# EAGLE design propulsion_shield (EAGLE 6.5.0)
CNAME: Kbots - Propulsion Shield; CREVISION: 1.0; DESIGNER: LAGORCE X., HAESSIG G.
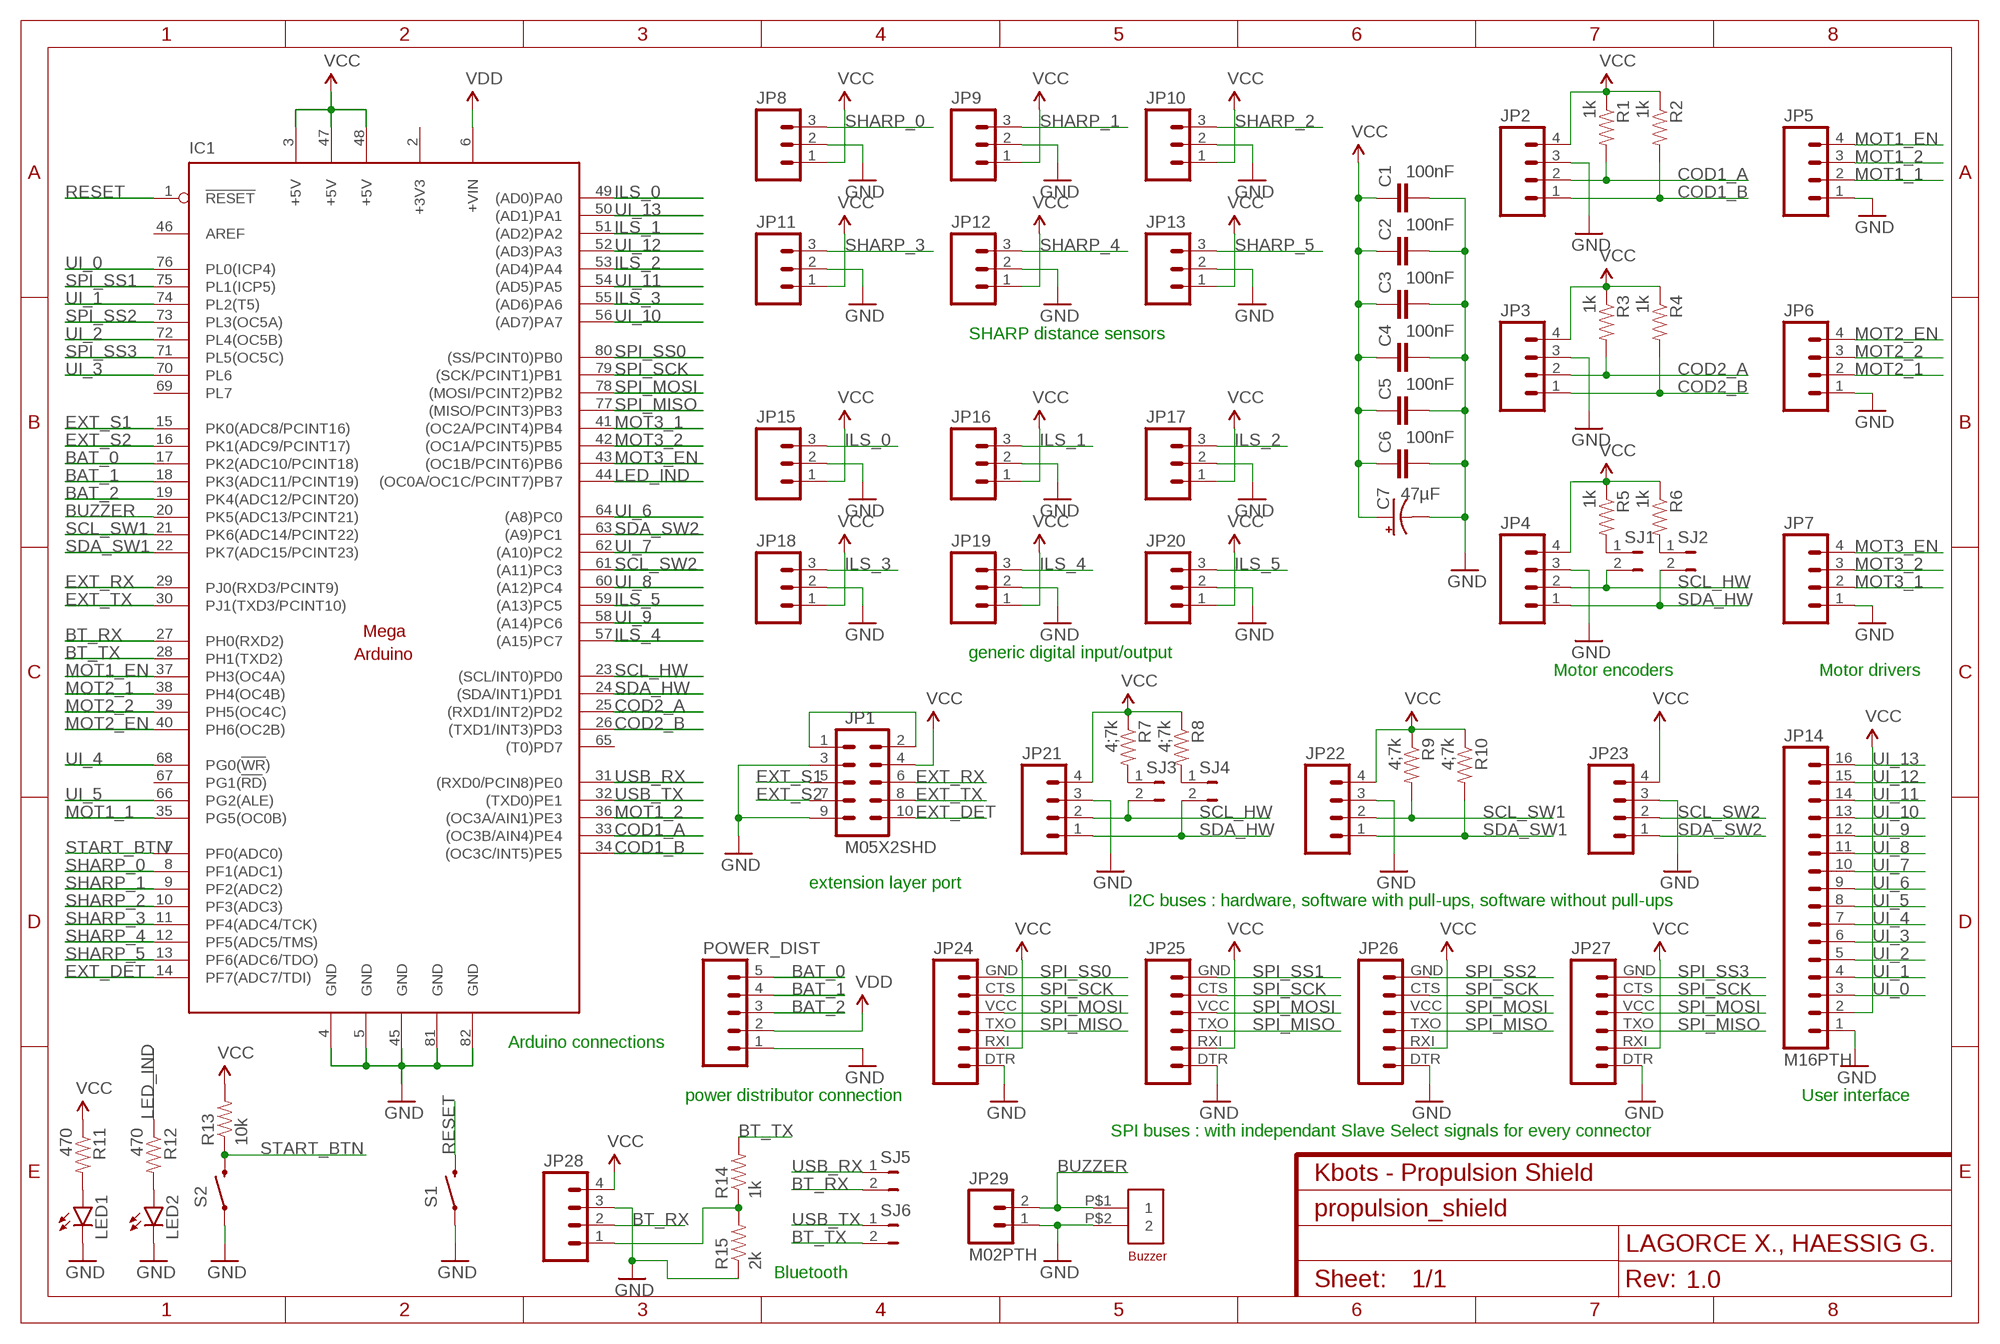
[diagram p0: schematic, sheet 1]

## Parts
C1  100nF  CAP1206  [1206]
C2  100nF  CAP1206  [1206]
C3  100nF  CAP1206  [1206]
C4  100nF  CAP1206  [1206]
C5  100nF  CAP1206  [1206]
C6  100nF  CAP1206  [1206]
C7  47µF  47UF-50V-20%(ELECT)  [PANASONIC_D]
IC1  MEGAARDUINO_13  [MEGA_ARDUINO_NO_HOLE]
JP1  M05X2SHD  [2X5-SHROUDED]
JP2  M04PTH  [1X04]
JP3  M04PTH  [1X04]
JP4  M04PTH  [1X04]
JP5  M04PTH  [1X04]
JP6  M04PTH  [1X04]
JP7  M04PTH  [1X04]
JP8  M03PTH  [1X03]
JP9  M03PTH  [1X03]
JP10  M03PTH  [1X03]
JP11  M03PTH  [1X03]
JP12  M03PTH  [1X03]
JP13  M03PTH  [1X03]
JP14  M16PTH  [1X16]
JP15  M03PTH  [1X03]
JP16  M03PTH  [1X03]
JP17  M03PTH  [1X03]
JP18  M03PTH  [1X03]
JP19  M03PTH  [1X03]
JP20  M03PTH  [1X03]
JP21  M04PTH  [1X04]
JP22  M04PTH  [1X04]
JP23  M04PTH  [1X04]
JP24  M06SIP  [1X06]
JP25  M06SIP  [1X06]
JP26  M06SIP  [1X06]
JP27  M06SIP  [1X06]
JP28  M04PTH  [1X04]
JP29  M02PTH  [1X02]
LED1  LED1206  [LED-1206]
LED2  LED1206  [LED-1206]
POWER_DIST  M05PTH  [1X05]
R1  1k  RESISTOR1206  [1206]
R2  1k  RESISTOR1206  [1206]
R3  1k  RESISTOR1206  [1206]
R4  1k  RESISTOR1206  [1206]
R5  1k  RESISTOR1206  [1206]
R6  1k  RESISTOR1206  [1206]
R7  4;7k  RESISTOR1206  [1206]
R8  4;7k  RESISTOR1206  [1206]
R9  4;7k  RESISTOR1206  [1206]
R10  4;7k  RESISTOR1206  [1206]
R11  470  RESISTOR1206  [1206]
R12  470  RESISTOR1206  [1206]
R13  10k  RESISTOR1206  [1206]
R14  1k  RESISTOR1206  [1206]
R15  2k  RESISTOR1206  [1206]
S1  SWITCH-MOMENTARY-2PTH  [TACTILE-PTH]
S2  SWITCH-MOMENTARY-2PTH  [TACTILE-PTH]
SJ1  JUMPER-PTH-2-NO  [PTH-JUMPER-2-NO_NO_SILK]
SJ2  JUMPER-PTH-2-NO  [PTH-JUMPER-2-NO_NO_SILK]
SJ3  JUMPER-PTH-2-NO  [PTH-JUMPER-2-NO_NO_SILK]
SJ4  JUMPER-PTH-2-NO  [PTH-JUMPER-2-NO_NO_SILK]
SJ5  JUMPER-PTH-2-NO  [PTH-JUMPER-2-NO_NO_SILK]
SJ6  JUMPER-PTH-2-NO  [PTH-JUMPER-2-NO_NO_SILK]
U$1  BUZZER  [BUZZER]

## Nets
BAT_0: IC1.17(PK2(ADC10/PCINT18)) POWER_DIST.5
BAT_1: IC1.18(PK3(ADC11/PCINT19)) POWER_DIST.4
BAT_2: IC1.19(PK4(ADC12/PCINT20)) POWER_DIST.3
BT_RX: IC1.27(PH0(RXD2)) JP28.2 SJ5.2
BT_TX: IC1.28(PH1(TXD2)) R14.2 SJ6.2
BUZZER: IC1.20(PK5(ADC13/PCINT21)) JP29.2 U$1.P$1
COD1_A: IC1.33((OC3B/AIN4)PE4) JP2.2 R1.2
COD1_B: IC1.34((OC3C/INT5)PE5) JP2.1 R2.2
COD2_A: IC1.25((RXD1/INT2)PD2) JP3.2 R3.2
COD2_B: IC1.26((TXD1/INT3)PD3) JP3.1 R4.2
EXT_DET: IC1.14(PF7(ADC7/TDI)) JP1.10
EXT_RX: IC1.29(PJ0(RXD3/PCINT9)) JP1.6
EXT_S1: IC1.15(PK0(ADC8/PCINT16)) JP1.5
EXT_S2: IC1.16(PK1(ADC9/PCINT17)) JP1.7
EXT_TX: IC1.30(PJ1(TXD3/PCINT10)) JP1.8
GND: C1.2 C2.2 C3.2 C4.2 C5.2 C6.2 C7.- IC1.4(GND) IC1.5(GND) IC1.45(GND) IC1.81(GND) IC1.82(GND) JP1.3 JP1.9 JP2.3 JP3.3 JP4.3 JP5.1 JP6.1 JP7.1 JP8.2 JP9.2 JP10.2 JP11.2 JP12.2 JP13.2 JP14.1 JP15.2 JP16.2 JP17.2 JP18.2 JP19.2 JP20.2 JP21.3 JP22.3 JP23.3 JP24.DTR JP25.DTR JP26.DTR JP27.DTR JP28.3 JP29.1 LED1.C LED2.C POWER_DIST.1 R15.1 S1.1 S2.1 U$1.P$2
ILS_0: IC1.49((AD0)PA0) JP15.3
ILS_1: IC1.51((AD2)PA2) JP16.3
ILS_2: IC1.53((AD4)PA4) JP17.3
ILS_3: IC1.55((AD6)PA6) JP18.3
ILS_4: IC1.57((A15)PC7) JP19.3
ILS_5: IC1.59((A13)PC5) JP20.3
LED_IND: IC1.44((OC0A/OC1C/PCINT7)PB7) R12.1
MOT1_1: IC1.35(PG5(OC0B)) JP5.2
MOT1_2: IC1.36((OC3A/AIN1)PE3) JP5.3
MOT1_EN: IC1.37(PH3(OC4A)) JP5.4
MOT2_1: IC1.38(PH4(OC4B)) JP6.2
MOT2_2: IC1.39(PH5(OC4C)) JP6.3
MOT2_EN: IC1.40(PH6(OC2B)) JP6.4
MOT3_1: IC1.41((OC2A/PCINT4)PB4) JP7.2
MOT3_2: IC1.42((OC1A/PCINT5)PB5) JP7.3
MOT3_EN: IC1.43((OC1B/PCINT6)PB6) JP7.4
N$1: JP1.1 JP1.2
N$2: R7.2 SJ3.1
N$3: R8.2 SJ4.1
N$4: R5.2 SJ1.1
N$5: R6.2 SJ2.1
N$6: LED1.A R11.2
N$7: LED2.A R12.2
N$9: JP28.1 R14.1 R15.2
RESET: IC1.1(!RESET) S1.3
SCL_HW: IC1.23((SCL/INT0)PD0) JP4.2 JP21.2 SJ1.2 SJ3.2
SCL_SW1: IC1.21(PK6(ADC14/PCINT22)) JP22.2 R9.2
SCL_SW2: IC1.61((A11)PC3) JP23.2
SDA_HW: IC1.24((SDA/INT1)PD1) JP4.1 JP21.1 SJ2.2 SJ4.2
SDA_SW1: IC1.22(PK7(ADC15/PCINT23)) JP22.1 R10.2
SDA_SW2: IC1.63((A9)PC1) JP23.1
SHARP_0: IC1.8(PF1(ADC1)) JP8.3
SHARP_1: IC1.9(PF2(ADC2)) JP9.3
SHARP_2: IC1.10(PF3(ADC3)) JP10.3
SHARP_3: IC1.11(PF4(ADC4/TCK)) JP11.3
SHARP_4: IC1.12(PF5(ADC5/TMS)) JP12.3
SHARP_5: IC1.13(PF6(ADC6/TDO)) JP13.3
SPI_MISO: IC1.77((MISO/PCINT3)PB3) JP24.TXO JP25.TXO JP26.TXO JP27.TXO
SPI_MOSI: IC1.78((MOSI/PCINT2)PB2) JP24.VCC JP25.VCC JP26.VCC JP27.VCC
SPI_SCK: IC1.79((SCK/PCINT1)PB1) JP24.CTS JP25.CTS JP26.CTS JP27.CTS
SPI_SS0: IC1.80((SS/PCINT0)PB0) JP24.GND
SPI_SS1: IC1.75(PL1(ICP5)) JP25.GND
SPI_SS2: IC1.73(PL3(OC5A)) JP26.GND
SPI_SS3: IC1.71(PL5(OC5C)) JP27.GND
START_BTN: IC1.7(PF0(ADC0)) R13.1 S2.3
UI_0: IC1.76(PL0(ICP4)) JP14.3
UI_1: IC1.74(PL2(T5)) JP14.4
UI_2: IC1.72(PL4(OC5B)) JP14.5
UI_3: IC1.70(PL6) JP14.6
UI_4: IC1.68(PG0(!WR!)) JP14.7
UI_5: IC1.66(PG2(ALE)) JP14.8
UI_6: IC1.64((A8)PC0) JP14.9
UI_7: IC1.62((A10)PC2) JP14.10
UI_8: IC1.60((A12)PC4) JP14.11
UI_9: IC1.58((A14)PC6) JP14.12
UI_10: IC1.56((AD7)PA7) JP14.13
UI_11: IC1.54((AD5)PA5) JP14.14
UI_12: IC1.52((AD3)PA3) JP14.15
UI_13: IC1.50((AD1)PA1) JP14.16
USB_RX: IC1.31((RXD0/PCIN8)PE0) SJ5.1
USB_TX: IC1.32((TXD0)PE1) SJ6.1
VCC: C1.1 C2.1 C3.1 C4.1 C5.1 C6.1 C7.+ IC1.3(+5V) IC1.47(+5V) IC1.48(+5V) JP1.4 JP2.4 JP3.4 JP4.4 JP8.1 JP9.1 JP10.1 JP11.1 JP12.1 JP13.1 JP14.2 JP15.1 JP16.1 JP17.1 JP18.1 JP19.1 JP20.1 JP21.4 JP22.4 JP23.4 JP24.RXI JP25.RXI JP26.RXI JP27.RXI JP28.4 R1.1 R2.1 R3.1 R4.1 R5.1 R6.1 R7.1 R8.1 R9.1 R10.1 R11.1 R13.2
VDD: IC1.6(+VIN) POWER_DIST.2
Unconnected: IC1.46(AREF) IC1.65((T0)PD7) IC1.67(PG1(!RD!)) IC1.69(PL7)

## Notes on the sheet
- SHARP distance sensors
- generic digital input/output
- Motor encoders | Motor drivers
- extension layer port
- I2C buses : hardware, software with pull-ups, software without pull-ups
- Arduino connections
- power distributor connection | User interface
- SPI buses : with independant Slave Select signals for every connector
- Bluetooth

## Power pins joined to a net without a drawn wire
+3V3: IC1.2(+3V3)

## Library data of the parts
C1-C6 = SparkFun-Capacitors:CAP: Capacitor Standard 0603 ceramic capacitor, and 0.1" leaded capacitor.
C7 = SparkFun-Capacitors:47UF-50V-20%(ELECT): CAP-10547; PROD_ID: CAP-10547
IC1 = arduino:MEGAARDUINO_1: The Arduino Mega is a microcontroller board based on the ATmega1280. - 54 digital input/output pins (of which 14 can be used as PWM outputs) - 16 analog inputs - 4 UARTs (hardware serial ports) - 16 MHz crystal oscillator - USB connection - power jack - ICSP header - reset button It contains everything needed to support the microcontroller; simply connect it to a computer with a USB cable or power it with a AC-to-DC adapter or battery to get started. The Mega is compatible with most shields designed for the Arduino Duemilanove or Diecimila. http://arduino.cc/en/Main/ArduinoBoardMega
JP1 = SparkFun-Connectors:M05X2: Header 5x2 Standard 10-pin dual row 0.1" header. Commonly used with AVR-ISP. Use with Spark Fun Electronics SKU: PRT-00778
JP2-JP7 JP21-JP23 JP28 = SparkFun-Connectors:M04: Header 4 Standard 4-pin 0.1" header. Use with straight break away headers (SKU : PRT-00116), right angle break away headers (PRT-00553), swiss pins (PRT-00743), machine pins (PRT-00117), and female headers (PRT-00115). Molex polarized connector foot print use with SKU : PRT-08231 with associated crimp pins and housings. 1MM SMD Version SKU: PRT-10208
JP8-JP13 JP15-JP20 = SparkFun-Connectors:M03: Header 3 Standard 3-pin 0.1" header. Use with straight break away headers (SKU : PRT-00116), right angle break away headers (PRT-00553), swiss pins (PRT-00743), machine pins (PRT-00117), and female headers (PRT-00115). Molex polarized connector foot print use with SKU : PRT-08232 with associated crimp pins and housings.
JP14 = SparkFun-Connectors:M16: 1x16 .1" header
JP24-JP27 = SparkFun-Connectors:M06: Header 6 Standard 6-pin 0.1" header. Use with straight break away headers (SKU : PRT-00116), right angle break away headers (PRT-00553), swiss pins (PRT-00743), machine pins (PRT-00117), and female headers (PRT-00115). Molex polarized connector foot print use with SKU : PRT-08094 with associated crimp pins and housings. NOTES ON THE VARIANTS LOCK and LOCK_LONGPADS... This footprint was designed to help hold the alignment of a through-hole component (i.e. 6-pin header) while soldering it into place. You may notice that each hole has been shifted either up or down by 0.005 of an inch from it's more standard position (which is a perfectly straight line). This slight alteration caused the pins (the squares in the middle) to touch the edges of the holes. Because they are alternating, it causes a "brace" to hold the component in place. 0.005 has proven to be the perfect amount of "off-center" position when using our standard breakaway headers. Although looks a little odd when you look at the bare footprint, once you have a header in there, the alteration is very hard to notice. Also,if you push a header all the way into place, it is covered up entirely on the bottom side. This idea of altering the position of holes to aid alignment will be further integrated into the Sparkfun Library for other footprints. It can help hold any component with 3 or more connection pins.
JP29 = SparkFun-Connectors:M02: Standard 2-pin 0.1" header. Use with - straight break away headers ( PRT-00116) - right angle break away headers (PRT-00553) - swiss pins (PRT-00743) - machine pins (PRT-00117) - female headers (PRT-00115) Molex polarized connector foot print use with: PRT-08233 with associated crimp pins and housings. 2.54_SCREWTERM for use with PRT-10571. 3.5mm Screw Terminal footprints for PRT-08084 5mm Screw Terminal footprints for use with PRT-08432
LED1 LED2 = SparkFun-LED:LED: LEDs Standard schematic elements and footprints for 5mm, 3mm, 1206, and 0603 sized LEDs. 5mm - Spark Fun Electronics SKU : COM-00529 (and others)
POWER_DIST = SparkFun-Connectors:M05: Header 5 Standard 5-pin 0.1" header. Use with straight break away headers (SKU : PRT-00116), right angle break away headers (PRT-00553), swiss pins (PRT-00743), machine pins (PRT-00117), and female headers (PRT-00115). Molex polarized connector foot print use with SKU : PRT-08230 with associated crimp pins and housings.
R1-R15 = SparkFun-Passives:RESISTOR: Resistor Basic schematic elements and footprints for 0603, 1206, and PTH resistors.
S1 S2 = SparkFun-Electromechanical:SWITCH-MOMENTARY-2: Various NO switches- pushbuttons, reed, etc
SJ1-SJ6 = SparkFun-Passives:JUMPER-PTH-2-NO
U$1 = buzzerG:BUZZER

## Board
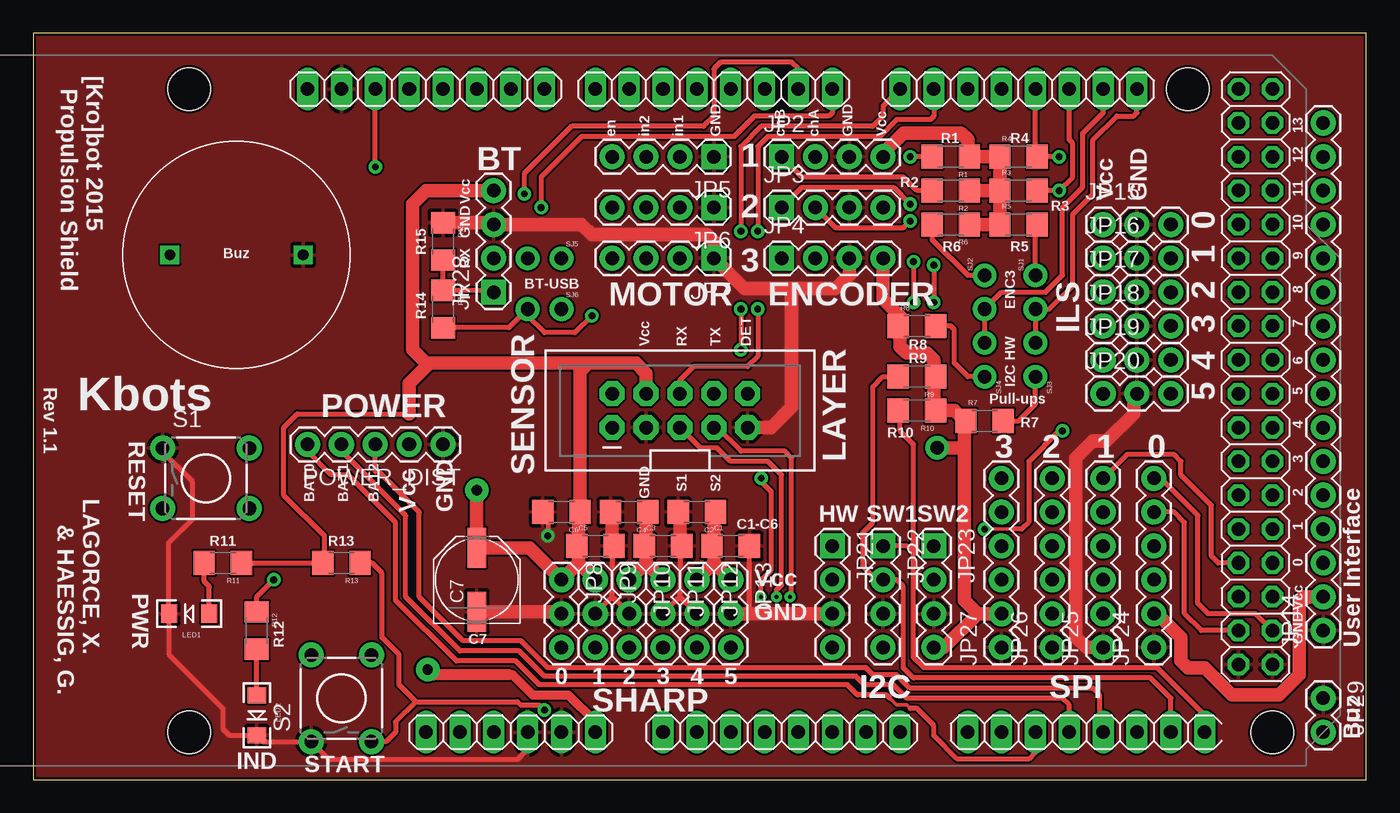
[diagram p1: board, top side]
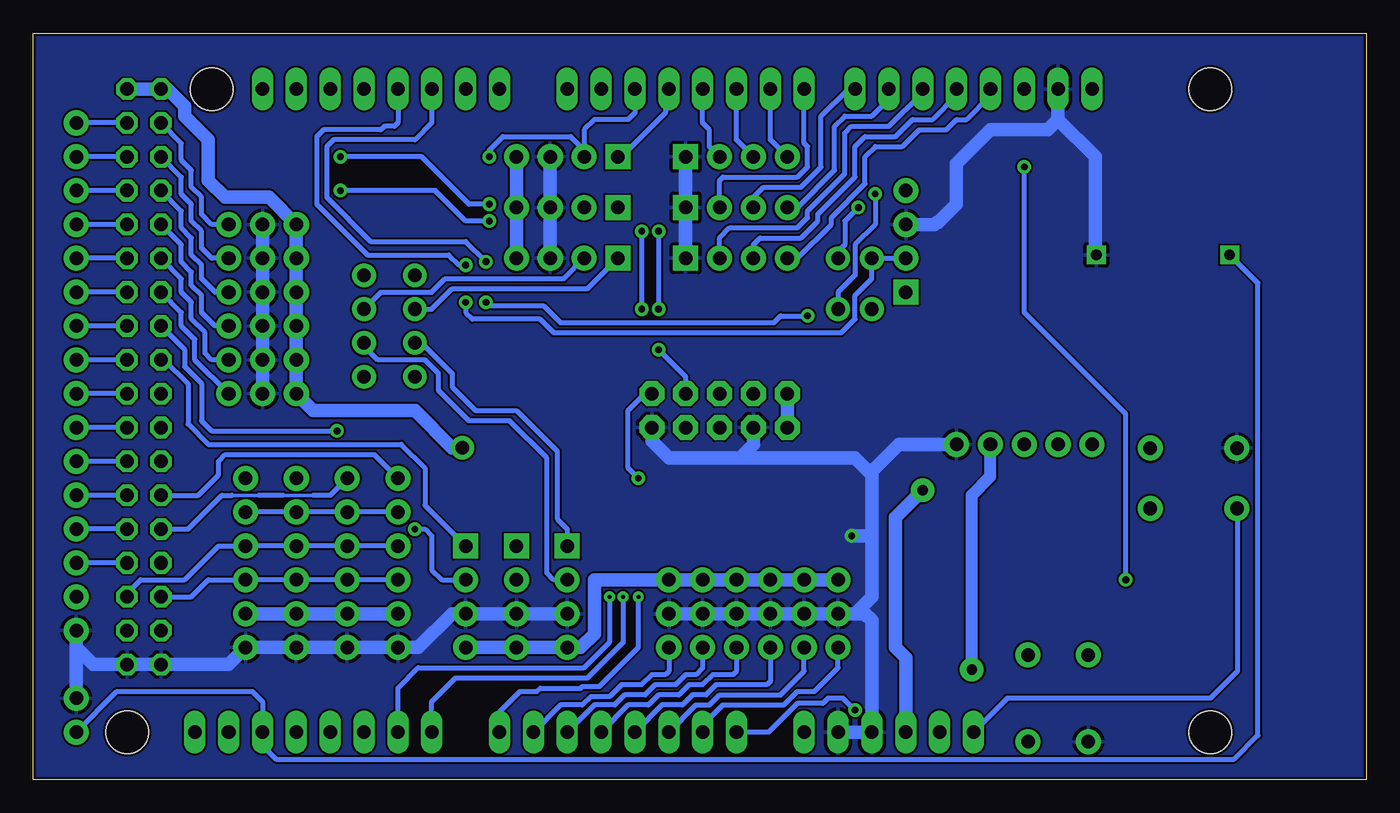
[diagram p2: board, bottom side, seen from below]

Size 100 x 56 mm. Coordinates in mm from the lower left corner, seen from the top.
Outline: 0,0 100,0 100,56 0,56 0,0
Copper layers (1*16): Top 0.035mm / dielectric 1.5mm / Bottom 0.035mm
Design rules "electrodragon": minimum track width 6mil, minimum drill 12mil, track to track 6mil, track to pad 6mil, pad to pad 6mil, via to via 6mil, smd to smd 6mil, copper to edge 8mil, drill to drill 6mil, minimum pad ring 12mil, minimum via ring 10mil, stop-mask expansion 4mil, vias tented up to drill 0mil, thermal gap 10mil

### Footprints (pad centres in the part's own frame; a part is rotated, then mirrored left to right if it is on the bottom)
1206 = smd 1.6 x 1.8: 1 -1.4,0; 2 1.4,0
PANASONIC_D = smd 3 x 1.4: + 2.4,0; - -2.4,0
MEGA_ARDUINO_NO_HOLE = drill 1.016 long: 1 33.02,2.54; 2 35.56,2.54; 3 38.1,2.54; 4 40.64,2.54; 5 43.18,2.54; 6 45.72,2.54; 7 50.8,2.54; 8 53.34,2.54; 9 55.88,2.54; 10 58.42,2.54; 11 60.96,2.54; 12 63.5,2.54; 13 66.04,2.54; 14 68.58,2.54; 15 73.66,2.54; 16 76.2,2.54; 17 78.74,2.54; 18 81.28,2.54; 19 83.82,2.54; 20 86.36,2.54; 21 88.9,2.54; 22 91.44,2.54; 23 86.36,50.8; 24 83.82,50.8; 25 81.28,50.8; 26 78.74,50.8; 27 76.2,50.8; 28 73.66,50.8; 29 71.12,50.8; 30 68.58,50.8; 31 63.5,50.8; 32 60.96,50.8; 33 58.42,50.8; 34 55.88,50.8; 35 53.34,50.8; 36 50.8,50.8; 37 48.26,50.8; 38 45.72,50.8; 39 41.91,50.8; 40 39.37,50.8; 41 36.83,50.8; 42 34.29,50.8; 43 31.75,50.8; 44 29.21,50.8; 45 26.67,50.8; 46 24.13,50.8 | drill 1.016 octagon: 47 93.98,50.8; 48 96.52,50.8; 49 93.98,48.26; 50 96.52,48.26; 51 93.98,45.72; 52 96.52,45.72; 53 93.98,43.18; 54 96.52,43.18; 55 93.98,40.64; 56 96.52,40.64; 57 93.98,38.1; 58 96.52,38.1; 59 93.98,35.56; 60 96.52,35.56; 61 93.98,33.02; 62 96.52,33.02; 63 93.98,30.48; 64 96.52,30.48; 65 93.98,27.94; 66 96.52,27.94; 67 93.98,25.4; 68 96.52,25.4; 69 93.98,22.86; 70 96.52,22.86; 71 93.98,20.32; 72 96.52,20.32; 73 93.98,17.78; 74 96.52,17.78; 75 93.98,15.24; 76 96.52,15.24; 77 93.98,12.7; 78 96.52,12.7; 79 93.98,10.16; 80 96.52,10.16; 81 93.98,7.62; 82 96.52,7.62 | hole 3.2: 15.24,50.8; 15.24,2.54; 90.17,50.8; 96.52,2.54
2X5-SHROUDED = drill 1.016 pad 1.88 octagon: 1 -1.27,5.08; 2 1.27,5.08; 3 -1.27,2.54; 4 1.27,2.54; 5 -1.27,0; 6 1.27,0; 7 -1.27,-2.54; 8 1.27,-2.54; 9 -1.27,-5.08; 10 1.27,-5.08
1X04 = drill 1.016 pad 1.88 square: 1 0,0 | drill 1.016 pad 1.88: 2 2.54,0; 3 5.08,0; 4 7.62,0
1X03 = drill 1.016 pad 1.88: 1 0,0; 2 2.54,0; 3 5.08,0
1X16 = drill 1.016 pad 1.88: 1 0,0; 2 2.54,0; 3 5.08,0; 4 7.62,0; 5 10.16,0; 6 12.7,0; 7 15.24,0; 8 17.78,0; 9 20.32,0; 10 22.86,0; 11 25.4,0; 12 27.94,0; 13 30.48,0; 14 33.02,0; 15 35.56,0; 16 38.1,0
1X06 = drill 1.016 pad 1.88: CTS 10.16,0; DTR 0,0; GND 12.7,0; RXI 2.54,0; TXO 5.08,0; VCC 7.62,0
1X02 = drill 1.016 pad 1.88: 1 0,0; 2 2.54,0
LED-1206 = smd 1.2 x 1.4: A -1.5,0; C 1.5,0
1X05 = drill 1.016 pad 1.88: 1 0,0; 2 2.54,0; 3 5.08,0; 4 7.62,0; 5 10.16,0
TACTILE-PTH = drill 1.016 pad 1.88: 1 -3.251,2.261; 2 3.251,2.261; 3 -3.251,-2.261; 4 3.251,-2.261
PTH-JUMPER-2-NO_NO_SILK = drill 1.016 pad 1.778: 1 -1.27,0; 2 1.27,0
BUZZER = drill 0.8 square: P$1 -5,0; P$2 5,0

### Placement (x,y rotation side)
C1  52.32,17.53 0 top
C2  49.78,20.07 180 top
C3  47.24,17.53 0 top
C4  44.7,20.07 180 top
C5  42.16,17.53 0 top
C6  39.62,20.07 180 top
C7  33.27,14.99 90 top
IC1  -3.56,1.02 0 top
JP1  48.51,27.69 90 top
JP2  56.13,46.74 0 top
JP3  56.13,42.93 0 top
JP4  56.13,39.12 0 top
JP5  51.05,46.74 180 top
JP6  51.05,42.93 180 top
JP7  51.05,39.12 180 top
JP8  39.62,14.99 270 top
JP9  42.16,14.99 270 top
JP10  44.7,14.99 270 top
JP11  47.24,14.99 270 top
JP12  49.78,14.99 270 top
JP13  52.32,14.99 270 top
JP14  96.77,11.18 90 top
JP15  80.26,41.66 0 top
JP16  80.26,39.12 0 top
JP17  80.26,36.58 0 top
JP18  80.26,34.04 0 top
JP19  80.26,31.5 0 top
JP20  80.26,28.96 0 top
JP21  59.94,17.53 270 top
JP22  63.75,17.53 270 top
JP23  67.56,17.53 270 top
JP24  84.07,9.91 90 top
JP25  80.26,9.91 90 top
JP26  76.45,9.91 90 top
JP27  72.64,9.91 90 top
JP28  34.54,36.58 90 top
JP29  96.77,6.1 270 top
LED1  11.68,12.45 180 top
LED2  16.76,4.83 270 top
POWER_DIST  30.73,25.15 180 top
R1  68.83,46.74 180 top
R2  68.83,44.2 180 top
R3  73.91,44.2 0 top
R4  73.91,46.74 0 top
R5  73.91,41.66 0 top
R6  68.83,41.66 180 top
R7  71.37,26.92 0 top
R8  66.29,34.04 0 top
R9  66.29,30.23 180 top
R10  66.29,27.69 180 top
R11  14.22,16.26 180 top
R12  16.76,11.18 270 top
R13  23.11,16.26 180 top
R14  30.73,35.31 270 top
R15  30.73,40.39 270 top
S1  12.95,22.61 0 top
S2  23.11,6.1 90 top
SJ1  75.18,36.58 270 top
SJ2  71.37,36.58 270 top
SJ3  75.18,31.5 90 top
SJ4  71.37,31.5 90 top
SJ5  38.35,39.12 180 top
SJ6  38.35,35.31 180 top
U$1  15.24,39.37 0 top

### Tracks (layer width: path | path; a pad name or v marks a point on that pad's centre or on a via)
BAT_0
  Top 0.254: 65.79,5.33 65.53,5.59 64.77,5.59 64.26,6.1
  Top 0.381: IC1.17 75.18,2.03 74.68,1.52 69.34,1.52 67.56,3.3 67.56,4.06 66.29,5.33 65.79,5.33 | 64.26,6.1 64.01,6.35 61.85,6.35 61.09,7.11 37.97,7.11 36.2,8.89 31.75,8.89 27.18,13.46 27.18,19.3 23.62,22.86 22.35,22.86 20.57,24.64 POWER_DIST.5
BAT_1
  Top 0.381: IC1.18 77.72,5.59 77.22,6.1 65.53,6.1 64.52,7.11 62.36,7.11 61.72,7.75 38.35,7.75 36.45,9.65 32,9.65 27.94,13.72 27.94,19.81 23.11,24.64 POWER_DIST.4
BAT_2
  Top 0.381: IC1.19 80.01,3.81 80.01,6.35 79.5,6.86 65.79,6.86 64.77,7.87 62.99,7.87 62.48,8.38 38.61,8.38 36.58,10.41 32.26,10.41 28.96,13.72 28.96,20.07 25.91,23.11 25.65,23.11 POWER_DIST.3
BT_RX  (via drill 0.51)
  Top 0.381: v67.56,38.61 v67.56,35.81
  Bottom 0.381: IC1.27 72.64,49.28 72.9,49.02 73.66,49.02 73.91,48.77 78.23,48.77 78.74,48.26 78.74,43.18 74.93,39.37 68.83,39.37 68.07,38.61 v67.56,38.61 | v67.56,35.81 67.56,35.05 67.06,34.54 61.98,34.54 60.96,33.53 39.37,33.53 38.35,34.54 38.35,36.32 37.08,37.59 SJ5.2 JP28.2
BT_TX  (via drill 0.51)
  Top 0.381: v66.04,38.86 v66.04,35.81 | R14.2 35.68,33.91 SJ6.2 37.08,34.8 38.35,33.53 40.64,33.53 v41.91,34.8
  Bottom 0.381: IC1.28 70.1,49.28 71.37,48.01 77.47,48.01 77.98,47.5 77.98,43.69 74.68,40.39 67.56,40.39 v66.04,38.86 | v66.04,35.81 65.79,35.56 61.72,35.56 60.45,34.29 44.45,34.29 43.94,34.8 v41.91,34.8
BUZZER
  Bottom 0.381: JP29.2 93.73,6.6 83.57,6.6 82.8,5.84 IC1.20 82.8,2.54 81.79,1.52 9.91,1.52 8.13,3.3 8.13,37.26 U$1.P$1
COD1_A  (via drill 0.51)
  Top 0.381: R1.2 v65.79,46.74
  Bottom 0.381: v65.79,46.74 65.79,47.24 64.77,48.26 59.69,48.26 58.67,47.24 JP2.2 58.67,48.77 57.91,49.53 55.37,49.53 54.86,50.04 IC1.33
COD1_B
  Top 0.381: R2.2 66.29,44.2 65.28,45.21 57.66,45.21 JP2.1
  Bottom 0.381: IC1.34 52.58,51.56 52.58,50.04 55.88,46.74 JP2.1
COD2_A  (via drill 0.51)
  Top 0.381: JP3.2 60.2,41.4 65.28,41.4 v65.79,41.91 | R3.2 v76.96,44.2 77.98,45.21 77.98,47.75 77.72,48.01 IC1.25
  Bottom 0.381: v65.79,41.91 67.56,41.91 69.85,44.2 v76.96,44.2
COD2_B  (via drill 0.51)
  Top 0.381: JP3.1 57.66,44.45 64.52,44.45 v65.79,43.18 | v76.96,46.74 R4.2 75.18,46.87 IC1.26
  Bottom 0.381: v65.79,43.18 67.31,43.18 70.87,46.74 v76.96,46.74
EXT_DET  (via drill 0.3, 0.51)
  Top 0.381: v54.61,13.72 54.61,14.99 55.37,15.75 55.37,21.59 54.61,22.35 v54.61,22.61
  Bottom 0.381: IC1.14 65.02,5.08 63.5,6.6 62.23,6.6 61.98,6.86 58.93,6.86 58.8,6.99 57.53,6.99 54.61,9.91 v54.61,13.72 | v54.61,22.61 55.37,23.37 55.37,27.69 54.1,28.96 JP1.10
EXT_RX  (via drill 0.51)
  Top 0.381: IC1.29 67.56,49.78 67.31,49.53 64.77,49.53 63.5,48.26 55.12,48.26 54.36,47.5 v54.36,41.15 | v54.36,35.31 54.36,31.75 53.59,30.99 49.53,30.99 48.51,29.97 JP1.6
  Bottom 0.381: v54.36,41.15 v54.36,35.31
EXT_S1  (via drill 0.3)
  Top 0.381: v55.75,13.72 55.75,14.22 56.13,14.61 56.13,22.86 55.12,23.88 52.32,23.88 51.31,24.89 50.04,24.89 JP1.5
  Bottom 0.381: IC1.15 70.1,5.84 68.33,7.62 58.42,7.62 55.75,10.29 v55.75,13.72
EXT_S2  (via drill 0.3)
  Top 0.381: v56.77,13.72 56.9,13.84 56.9,24.13 56.39,24.64 53.09,24.64 51.31,26.42 JP1.7
  Bottom 0.381: IC1.16 72.64,6.86 71.12,8.38 58.67,8.38 56.77,10.29 v56.77,13.72
EXT_TX  (via drill 0.51)
  Top 0.381: IC1.30 63.75,50.55 63.75,49.78 62.99,49.02 54.61,49.02 53.09,47.5 v53.09,41.15 | v53.09,35.31 v53.09,32.26
  Bottom 0.381: v53.09,41.15 v53.09,35.31 | v53.09,32.26 51.05,30.23 JP1.8
GND  (via drill 0.51)
  Top 0.254: 48.51,17.4 48.51,17.27 | 48.51,15.75 48.51,14.22 | 43.43,17.4 43.43,17.27 | 43.43,15.75 43.43,14.22
  Top 0.381: JP13.2 53.34,12.45 53.72,12.83 C1.2 | C2.2 48.64,19.81 C3.2 48.51,17.4 | 48.64,13.59 48.51,13.72 48.51,14.22 | 48.64,13.59 JP12.2 | C4.2 43.56,19.81 C5.2 43.43,17.4 | 43.56,13.59 43.43,13.72 43.43,14.22 | 43.56,13.59 JP10.2 | JP11.2 48.39,13.59 48.64,13.59 | JP9.2 43.31,13.59 43.56,13.59 | 43.43,17.27 43.43,15.75 | 48.51,17.27 48.51,15.75 | C6.2 38.61,19.68 v38.61,18.29 | S1.1 9.7,24.59 11.94,22.35 11.94,19.56 10.16,17.78 10.16,12.47 LED1.C 10.16,12.42 10.16,9.4 14.22,5.33 14.22,3.81 14.71,3.33 LED2.C 17.25,2.85 S2.1 22.17,1.52 36.32,1.52 37.08,2.29 IC1.4
  Top 1.016: JP20.2 82.55,28.7 82.55,27.43 80.52,25.4 79.5,25.4 78.23,24.13 78.23,10.67 78.99,9.91 JP25.DTR | R15.1 34.41,41.79 JP28.3 41.15,41.66 41.91,40.89 50.55,40.89 51.05,40.39 JP7.1 53.34,36.83 56.9,36.83 | 56.9,36.83 60.2,36.83 61.21,37.85 JP4.3 | JP21.3 JP13.2 | JP8.2 39.48,12.59 C7.- | 48.51,20.07 48.51,17.27 | 43.43,20.07 43.43,17.27 | JP1.9 55.37,26.42 56.9,27.94 56.9,36.83
  Bottom 0.381: 39.37,12.45 JP8.2
  Bottom 1.016: JP15.2 JP16.2 JP17.2 JP18.2 JP19.2 JP20.2 | JP22.3 JP23.3 68.58,12.45 71.12,9.91 JP27.DTR JP26.DTR JP25.DTR JP24.DTR 85.34,8.64 IC1.81 IC1.82 95.5,8.64 96.77,9.91 JP14.1 JP29.1 | 63.5,12.45 JP22.3 | JP22.3 JP21.3 | JP4.3 JP3.3 JP2.3 | JP5.1 JP6.1 JP7.1 | 23.11,49.53 23.88,48.77 28.19,48.77 30.73,46.23 30.73,43.18 32.13,41.79 32.26,41.79 32.39,41.66 JP28.3 | JP13.2 JP12.2 JP11.2 JP10.2 JP9.2 JP8.2 | IC1.5 IC1.4 37.08,11.94 37.59,12.45 38.35,12.45 | JP1.3 45.97,25.15 46.99,24.13 | 46.99,24.13 52.32,24.13 53.59,25.4 JP1.9 | 46.99,24.13 38.35,24.13 37.47,23.24 | 37.47,23.24 37.08,22.86 37.08,18.29 | 37.08,18.29 37.08,13.72 38.35,12.45 | 38.35,12.45 39.37,12.45 | v38.61,18.29 37.08,18.29 | POWER_DIST.1 35.05,25.15 36.96,23.24 37.47,23.24 | IC1.45 23.11,49.53 | 23.11,49.53 20.32,46.74 20.32,39.37
  pour Bottom (isolate 0.015): 0,0 0,56 100,56 100,0
  pour Top (isolate 0.015): 0,0 0,56 100,56 100,0
ILS_0
  Bottom 0.381: JP15.3 86.61,41.66 87.38,42.42 87.38,43.69 88.14,44.45 88.14,45.72 88.9,46.48 88.9,47.75 IC1.49
ILS_1
  Bottom 0.381: JP16.3 86.61,39.12 87.38,39.88 87.38,41.15 88.14,41.91 88.14,43.18 88.9,43.94 88.9,45.21 IC1.51
ILS_2
  Bottom 0.381: JP17.3 86.36,36.58 87.38,37.59 87.38,38.61 88.14,39.37 88.14,40.64 88.9,41.4 88.9,42.67 IC1.53
ILS_3
  Bottom 0.381: JP18.3 86.36,34.04 87.38,35.05 87.38,36.32 88.14,37.08 88.14,38.1 88.9,38.86 88.9,40.13 IC1.55
ILS_4
  Bottom 0.381: JP19.3 86.61,31.5 87.12,32 87.12,33.53 88.14,34.54 88.14,35.81 88.9,36.58 88.9,37.59 IC1.57
ILS_5
  Bottom 0.381: JP20.3 87.88,31.5 87.88,33.02 88.9,34.04 88.9,35.05 IC1.59
LED_IND  (via drill 0.51)
  Top 0.381: R12.1 16.76,13.72 v18.03,14.99 | v25.65,45.97 IC1.44
  Bottom 0.381: v18.03,14.99 18.03,27.43 25.65,35.05 v25.65,45.97
MOT1_1
  Bottom 0.381: JP5.2 49.28,47.5 49.28,48.77 49.78,49.28 IC1.35
MOT1_2
  Bottom 0.381: JP5.3 47.24,48.01 IC1.36
MOT1_EN
  Bottom 0.381: JP5.4 44.7,48.01 IC1.37
MOT2_1
  Bottom 0.381: JP6.2 48.51,44.96 48.26,45.21 42.67,45.21 41.91,45.97 41.91,47.5 42.16,47.75 IC1.38
MOT2_2
  Bottom 0.381: JP6.3 45.97,43.69 45.21,44.45 42.42,44.45 40.89,45.97 40.89,49.78 38.86,51.82 IC1.39
MOT2_EN
  Bottom 0.381: JP6.4 42.67,42.93 39.88,45.72 39.88,49.02 39.12,49.78 37.08,49.78 35.81,51.05 IC1.40
MOT3_1
  Bottom 0.381: JP7.2 48.51,40.64 47.75,41.4 42.67,41.4 41.91,42.16 41.91,42.67 39.12,45.47 39.12,48.51 38.61,49.02 35.81,49.02 33.27,51.56 IC1.41
MOT3_2
  Bottom 0.381: JP7.3 45.97,40.13 45.47,40.64 42.42,40.64 41.15,41.91 41.15,42.42 38.35,45.21 38.35,47.5 37.59,48.26 35.31,48.26 34.04,49.53 32.51,49.53 30.73,51.31 IC1.42
MOT3_EN
  Bottom 0.381: JP7.4 42.67,39.12 40.13,41.66 40.13,42.16 37.59,44.7 37.59,46.74 36.83,47.5 34.8,47.5 33.53,48.77 31.5,48.77 30.73,49.53 29.97,49.53 28.19,51.31 IC1.43
N$1
  Bottom 1.016: JP1.2 JP1.1
N$2
  Top 0.381: R7.2 73.91,26.92 75.18,28.19 SJ3.1
N$3
  Top 0.381: SJ4.1 70.1,30.23 69.09,31.24 69.09,33.78 68.83,34.04 R8.2
N$4
  Top 0.381: SJ1.1 75.18,41.53 R5.2
N$5
  Top 0.381: R6.2 67.43,40.52 70.1,37.85 SJ2.1
N$6
  Top 0.381: LED1.A 13.21,12.47 13.21,14.48 12.82,14.86 R11.2
N$7
  Top 0.381: LED2.A R12.2
N$9
  Top 0.381: R15.2 R14.1 34.41,36.71 JP28.1
RESET
  Bottom 0.381: S1.3 9.65,20.3 9.65,8.13 11.68,6.1 26.92,6.1 IC1.1
SCL_HW
  Top 0.381: IC1.23 82.8,50.04 82.55,49.78 81.28,49.78 79.5,48.01 79.5,43.94 77.98,42.42 77.98,37.08 76.2,35.31 SJ1.2 SJ3.2
  Bottom 0.381: SJ1.2 73.91,36.58 70.1,36.58 69.09,37.59 60.2,37.59 JP4.2 | JP21.2 60.96,14.99 61.47,15.49 61.47,24.13 64.26,26.92 67.31,26.92 69.6,29.21 69.6,30.48 70.61,31.5 74.17,31.5 75.18,32.51 SJ3.2
SCL_SW1
  Top 0.381: IC1.21 85.34,6.1 83.82,7.62 66.04,7.62 65.28,8.38 65.28,14.48 64.77,14.99 JP22.2 63.25,14.99 62.23,16 62.23,18.54 62.99,19.3 62.99,29.46 63.75,30.23 R9.2
SCL_SW2  (via drill 0.51)
  Top 0.254: 73.41,18.8 v71.37,18.8
  Top 0.381: 73.41,18.8 74.17,18.8 74.68,19.3 74.68,23.88 76.96,26.16 v77.22,26.16
  Bottom 0.381: IC1.61 88.65,32.26 88.65,30.99 87.38,29.72 87.38,26.92 86.61,26.16 v77.22,26.16 | v71.37,18.8 70.61,18.8 70.1,18.29 70.1,15.75 69.34,14.99 JP23.2
SDA_HW
  Top 0.381: IC1.24 80.26,50.04 78.74,48.51 78.74,44.45 77.22,42.93 77.22,37.85 75.95,36.58 72.64,36.58 SJ2.2 SJ4.2
  Bottom 0.381: SJ2.2 70.1,35.31 68.58,36.83 58.42,36.83 JP4.1 | SJ4.2 71.12,32.51 70.61,32.51 68.58,30.48 68.58,29.46 66.8,27.69 63.75,27.69 60.71,24.64 60.71,19.56 59.94,18.8 JP21.1
SDA_SW1
  Top 0.381: IC1.22 87.88,4.83 84.33,8.38 66.8,8.38 66.04,9.14 66.04,17.02 | JP22.1 65.53,17.53 66.04,17.02 | 66.04,17.02 66.04,25.15 65.02,26.16 65.02,27.56 R10.2
SDA_SW2
  Bottom 0.381: IC1.63 90.17,31.5 88.39,29.72 88.39,26.67 86.87,25.15 72.39,25.15 70.61,23.37 70.61,20.57 JP23.1
SHARP_0
  Bottom 0.381: IC1.8 49.78,4.06 48.26,5.59 43.69,5.59 42.67,6.6 41.4,6.6 39.62,8.38 JP8.3
SHARP_1
  Bottom 0.381: IC1.9 50.29,5.59 49.28,5.59 48.51,6.35 43.94,6.35 42.16,8.13 JP9.3
SHARP_2
  Bottom 0.381: JP10.3 44.7,7.37 44.96,7.11 48.77,7.11 49.53,6.35 50.55,6.35 51.31,5.59 52.83,5.59 IC1.10
SHARP_3
  Bottom 0.381: JP11.3 47.24,8.13 47.5,7.87 49.02,7.87 49.78,7.11 50.8,7.11 51.56,6.35 53.09,6.35 53.85,5.59 55.37,5.59 IC1.11
SHARP_4
  Bottom 0.381: JP12.3 49.78,8.38 50.29,7.87 51.05,7.87 51.82,7.11 53.34,7.11 54.1,6.35 55.63,6.35 56.39,5.59 57.91,5.59 IC1.12
SHARP_5
  Bottom 0.381: JP13.3 52.32,8.13 52.58,7.87 53.59,7.87 54.36,7.11 55.88,7.11 56.77,6.22 58.17,6.22 58.8,5.59 60.45,5.59 IC1.13
SPI_MISO
  Bottom 0.381: JP27.TXO JP26.TXO JP25.TXO JP24.TXO 86.87,14.99 88.14,13.72 IC1.77
SPI_MOSI
  Bottom 0.381: JP27.VCC JP26.VCC JP25.VCC JP24.VCC 86.11,17.53 88.65,14.99 91.95,14.99 92.96,13.97 IC1.78
SPI_SCK
  Top 0.381: IC1.79 87.63,11.18 86.36,12.45 86.36,19.3 85.6,20.07 JP24.CTS
  Bottom 0.381: JP27.CTS JP26.CTS JP25.CTS JP24.CTS
SPI_SS0
  Top 0.381: IC1.80 91.69,12.45 88.14,12.45 87.38,13.21 87.38,19.81 84.58,22.61 JP24.GND
SPI_SS1
  Top 0.381: IC1.75 88.9,16.26 88.39,16.76 88.39,20.57 86.11,22.86 86.11,23.88 85.6,24.38 82.04,24.38 JP25.GND
SPI_SS2
  Bottom 0.254: 85.09,21.34 83.06,21.34 | 81.28,21.34 78.99,21.34
  Bottom 0.381: IC1.73 88.39,18.8 85.85,21.34 85.09,21.34 | 78.99,21.34 77.72,21.34 JP26.GND | 81.28,21.34 83.06,21.34
SPI_SS3
  Bottom 0.381: IC1.71 87.63,21.34 86.11,22.86 86.11,23.88 85.6,24.38 74.42,24.38 JP27.GND
START_BTN  (via drill 0.51 pad 0.61)
  Top 0.381: 28.7,5.84 27.18,4.32 27.18,3.56 26.47,2.85 S2.3 | 28.7,5.84 27.43,7.11 27.43,9.4 26.16,10.67 26.16,15.49 25.4,16.26 R13.1 | 28.7,5.84 36.32,5.84 36.58,5.59 37.97,5.59 v38.35,5.21
  Bottom 0.381: v38.35,5.21 39.24,6.1 40.39,6.1 40.77,5.71 42.67,5.71 44.83,3.56 IC1.7
UI_0
  Bottom 0.381: IC1.76 JP14.3
UI_1
  Bottom 0.381: IC1.74 JP14.4
UI_2
  Bottom 0.381: IC1.72 JP14.5
UI_3
  Bottom 0.381: IC1.70 JP14.6
UI_4
  Bottom 0.381: IC1.68 JP14.7
UI_5
  Bottom 0.381: IC1.66 JP14.8
UI_6
  Bottom 0.381: IC1.64 JP14.9
UI_7
  Bottom 0.381: IC1.62 JP14.10
UI_8
  Bottom 0.381: IC1.60 JP14.11
UI_9
  Bottom 0.381: IC1.58 JP14.12
UI_10
  Bottom 0.381: IC1.56 JP14.13
UI_11
  Bottom 0.381: IC1.54 JP14.14
UI_12
  Bottom 0.381: IC1.52 JP14.15
UI_13
  Bottom 0.381: IC1.50 JP14.16
USB_RX  (via drill 0.51)
  Top 0.381: IC1.31 59.94,50.04 59.69,49.78 54.1,49.78 52.58,48.26 41.15,48.26 38.1,45.21 v38.1,42.93
  Bottom 0.381: v38.1,42.93 39.12,41.91 39.12,40.13 39.62,39.62 SJ5.1
USB_TX  (via drill 0.51)
  Top 0.381: IC1.32 57.4,53.34 56.9,53.85 51.56,53.85 51.05,53.34 51.05,49.78 50.29,49.02 40.39,49.02 36.83,45.47 v36.83,43.94
  Bottom 0.381: v36.83,43.94 36.83,41.66 38.35,40.13 38.35,37.85 39.62,36.58 SJ6.1
VCC  (via drill 0.76 pad 1.78, 1.02 pad 1.78)
  Top 0.381: 84.33,12.45 85.85,10.92 85.85,8.89 86.11,8.64 87.88,8.64 90.17,6.35 93.47,6.35 | 95,7.87 95,12.7 96.01,13.72 JP14.2 | R8.1 64.89,34.93 64.77,35.05 | R9.1 67.69,31.11 67.56,31.24 | 51.05,16.26 50.92,16.39 | 50.92,16.39 C1.1 50.92,19.81 C2.1 | JP12.1 50.92,16.13 50.92,16.39 | 46.1,16.13 45.97,16.26 45.97,17.4 C3.1 45.84,19.81 C4.1 | 46.1,16.13 JP11.1 | JP10.1 45.85,16.13 46.1,16.13 | 40.89,17.27 40.89,17.4 C5.1 41.02,17.79 C6.1 | R11.1 R13.2 21.84,16.39 21.84,18.29 18.8,21.34 18.8,26.42 19.81,27.43 28.19,27.43 | R7.1 69.85,26.8 69.85,25.91
  Top 1.016: JP14.2 95.25,13.72 95,13.46 95,7.87 93.47,6.35 89.92,6.35 87.88,8.38 86.61,8.38 86.11,8.89 86.11,10.67 84.33,12.45 JP24.RXI | JP27.RXI 70.87,12.45 | 70.87,12.45 69.85,13.46 69.85,24.89 | 69.85,24.89 69.85,25.91 69.85,26.92 69.09,27.69 R10.1 67.56,27.69 67.56,31.24 67.56,31.5 67.06,32 65.53,32 65.02,32.51 65.02,34.8 64.77,35.05 63.75,36.07 JP4.4 | JP23.4 68.33,9.91 70.87,12.45 | R6.1 R5.1 R3.1 | R2.1 R3.1 | R3.1 R4.1 R1.1 70.1,46.87 70.1,48.01 69.6,48.51 65.28,48.51 63.75,46.99 JP2.4 | v67.82,24.89 69.85,24.89 | JP11.1 45.97,16.26 | 45.97,16.26 45.97,20.07 | JP10.1 45.97,16.26 | JP12.1 51.05,16.26 | JP13.1 51.05,16.26 | 51.05,16.26 51.05,20.07 | 40.89,20.07 40.89,17.27 40.89,16.26 | 40.89,16.26 JP8.1 37.22,17.39 C7.+ v33.27,21.72 | JP9.1 40.89,16.26 | JP28.4 29.46,44.2 28.45,43.18 28.45,32.26 29.46,31.24 | 29.46,31.24 41.66,31.24 | JP1.4 45.97,30.48 45.21,31.24 41.66,31.24 | 41.66,31.24 41.02,30.61 C6.1 | 28.19,27.43 28.19,29.72 29.46,30.99 29.46,31.24
  Bottom 1.016: JP15.1 JP16.1 JP17.1 JP18.1 JP19.1 JP20.1 | IC1.47 IC1.48 | JP24.RXI JP25.RXI JP26.RXI JP27.RXI | JP15.1 80.26,41.91 | 90.17,51.82 IC1.47 | JP23.4 JP22.4 JP21.4 58.93,9.91 57.91,10.92 57.91,14.99 JP13.1 JP12.1 JP11.1 JP10.1 JP9.1 JP8.1 | JP2.4 JP3.4 JP4.4 | JP15.1 82.3,43.69 85.6,43.69 86.87,44.96 86.87,48.01 88.65,49.78 88.65,50.55 89.92,51.82 IC1.47 | JP15.1 JP20.1 | JP20.1 78.99,27.69 71.37,27.69 68.58,24.89 v67.82,24.89 | IC1.3 34.54,9.14 35.31,9.91 35.31,19.68 v33.27,21.72
VDD  (via drill 0.76 pad 1.78)
  Top 0.66: 35.69,7.87 35.94,7.87 37.47,6.35 40.13,6.35 42.16,4.32
  Top 0.813: IC1.6 42.16,4.32 | 35.69,7.87 29.97,7.87
  Top 0.889: 29.97,7.87 v29.59,8.26
  Bottom 0.889: v29.59,8.26 29.59,21.34 28.19,22.73 POWER_DIST.2

### Text on the board
tPlace: [Kro]bot 2015 / Propulsion Shield | R4 | 13 | en | in2 | in1 | GND | chB | chA | GND | Vcc | R1 | 12 | BT | 1 | 11 | R2 | Vcc | R3 | Vcc | GND | 0 | 2 | 10 | GND | R6 | R5 | 1 | 9 | Buz | R15 | RX | 3 | BT-USB | 8 | TX | MOTOR | ENCODER | 2 | R14 | ENC3 | 7 | ILS | 3 | Vcc | RX | TX | DET | R8 | R9 | 6 | 4 | Rev 1.1 | I2C HW | Pull-ups | 5 | Kbots | 5 | POWER | R7 | 4 | R10 | RESET | LAYER | 3 | 2 | 1 | 0 | 3 | SENSOR | S1 | S2 | 2 | LAGORCE, X. / & HAESSIG, G. | BAT0 | BAT1 | BAT2 | GND | Vcc | GND | C1-C6 | HW | SW1 | SW2 | 1 | R11 | R13 | 0 | PWR | Vcc | Vcc | GND | C7 | R12 | GND | User Interface | 0 | 1 | 2 | 3 | 4 | 5 | I2C | SPI | SHARP | Buz | IND | START